# EAGLE schematic battery_gauge_max17043g+u (EAGLE 6.1)
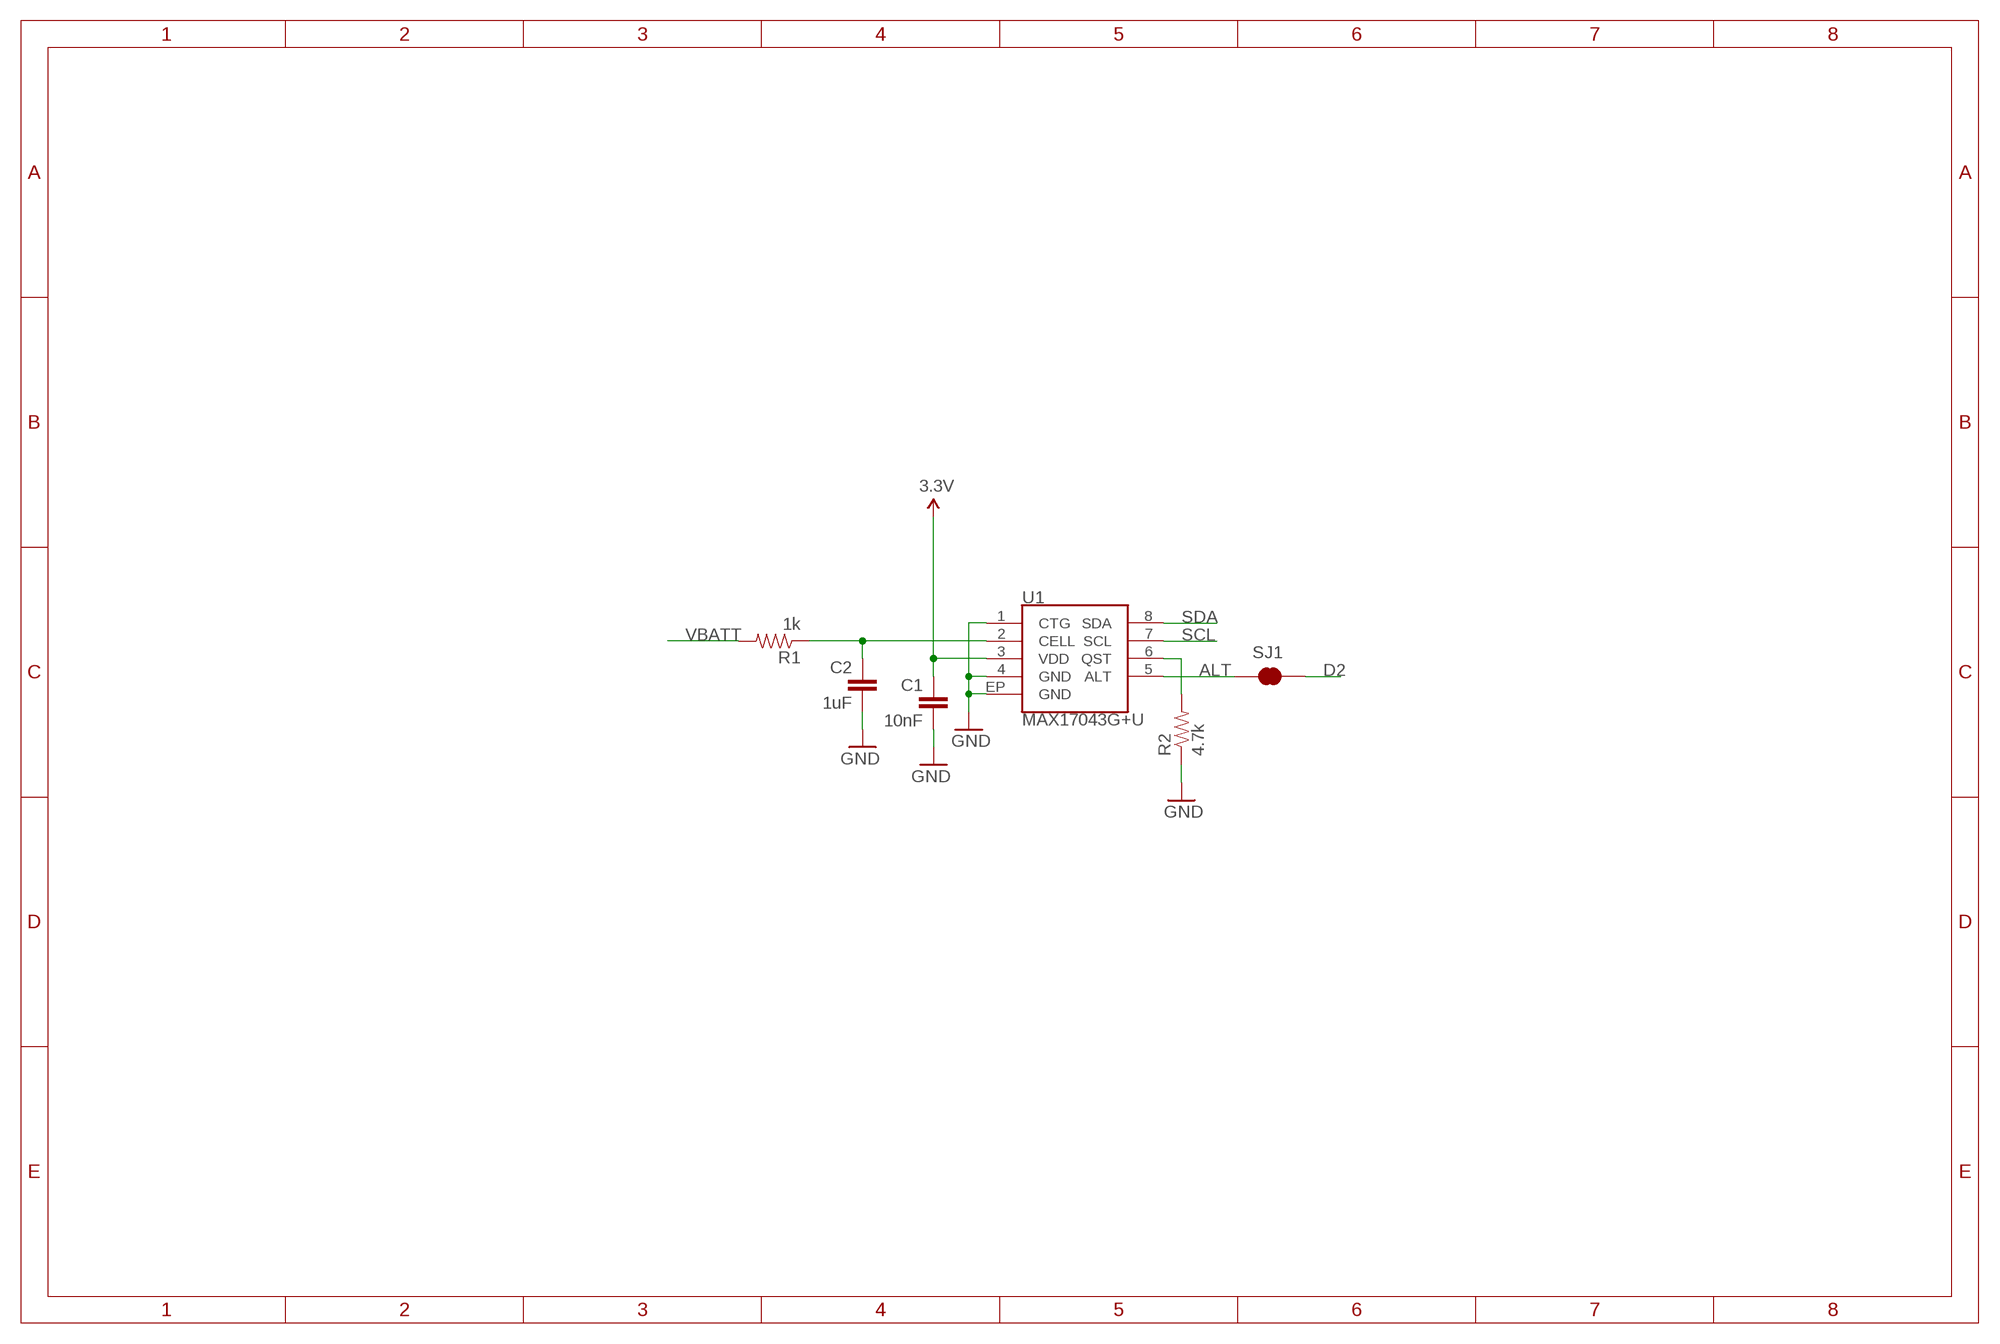
[diagram p0: schematic, sheet 1]

## Parts
C1  10nF  CAP0402-CAP  [0402-CAP]
C2  1uF  CAP0402-CAP  [0402-CAP]
R1  1k  RESISTOR0402-RES  [0402-RES]
R2  4.7k  RESISTOR0402-RES  [0402-RES]
SJ1  SOLDERJUMPERTRACE  [SJ_2S-TRACE]
U1  MAX17043G+U  MAX1704X  [TDFN-8]

## Nets
3.3V: C1.1 U1.3(VDD)
ALT: SJ1.1 U1.5(ALT)
CELL: C2.1 R1.1 U1.2(CELL)
D2: SJ1.2
GND: C1.2 C2.2 R2.1 U1.1(CTG) U1.4(GND) U1.EP(GND)
QST: R2.2 U1.6(QST)
SCL: U1.7(SCL)
SDA: U1.8(SDA)
VBATT: R1.2

## Library data of the parts
C1 C2 = SparkFun:CAP: Capacitor Standard 0603 ceramic capacitor, and 0.1" leaded capacitor.
R1 R2 = SparkFun:RESISTOR: Resistor Basic schematic elements and footprints for 0603, 1206, and PTH resistors.
SJ1 = SparkFun:SOLDERJUMPER: Solder Jumper Standard SMD solder jumper. Used to automate production. Two varients : Normally Open and Normally Closed are the same, but have different paste layers. NC will have a large amount of paste and should jumper during reflow.
U1 = SparkFun:MAX1704X: MAX17043/MAX17044: Battery Fuel Guage (43 is 1cell, 44 is 2cell)